# Altium schematic sheet Mosfet.SchDoc
size 381 x 241 mm
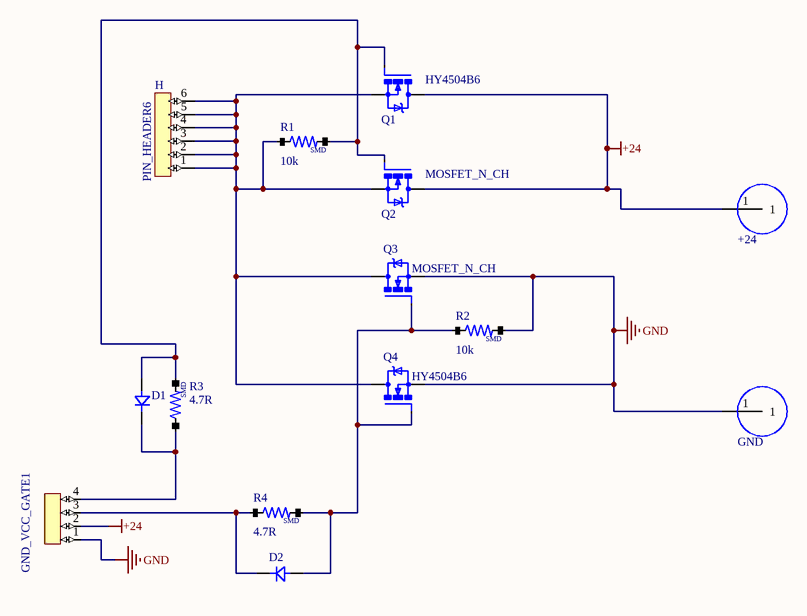
[diagram p0: Mosfet.SchDoc]

## Parts
+24  PIN1  [PIN1]  (value not drawn)
D1  (no value)  [mini_melf]
D2  (no value)  [mini_melf]
GND  PIN1  [PIN1]  (value not drawn)
GND_VCC_GATE1  CONECTOR/XH/4PIN  [CONECTOR/XH/4PIN]  (value not drawn)
H  PIN_HEADER6  [pin_header_6pin]
Q1  HY4504B6  [TO-263-6L]
Q2  MOSFET_N_CH  [HYG025N06LS1C2]
Q3  MOSFET_N_CH  [TO-263-6L]
Q4  HY4504B6  [HYG025N06LS1C2]
R1  10k  [RES/0603]
R2  10k  [RES/0603]
R3  4.7R  [RES/0805]
R4  4.7R  [RES/0805]

## Nets
+24: +24.1 GND_VCC_GATE1.2 Q1.2(D) Q2.2(D)
GND: GND.1 GND_VCC_GATE1.1 Q3.3(s) Q4.3(s) R2.2
NetD1_A: D1.A Q1.1(G) Q2.1(G) R1.2 R3.2
NetD1_K: D1.K GND_VCC_GATE1.4 R3.1
NetD2_A: D2.A Q3.1(G) Q4.1(G) R2.1 R4.2
NetD2_K: D2.K GND_VCC_GATE1.3 R4.1
NetH_1: H.1 H.2 H.3 H.4 H.5 H.6 Q1.3(s) Q2.3(s) Q3.2(D) Q4.2(D) R1.1

## Notes on the sheet
- (in symbol RES/SMD) SMD

## Library data of the parts
D1 D2 = DIOD/RECTIFIERS
Q1 Q4 = MOSFET_N_CH
R1-R4 = RES/SMD